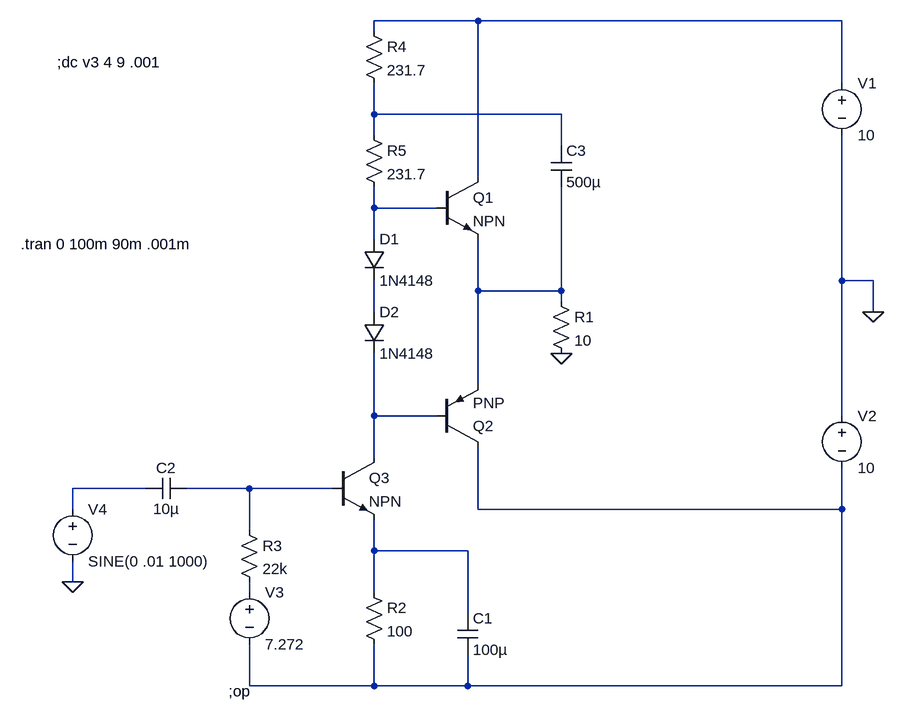
[diagram p0: schematic claseabteo3.asc]
claseabteo3.asc, the LTspice schematic file:
Version 4
SHEET 1 888 732
WIRE 256 -320 96 -320
WIRE 816 -320 256 -320
WIRE 96 -304 96 -320
WIRE 816 -224 816 -320
WIRE 96 -176 96 -224
WIRE 384 -176 96 -176
WIRE 96 -144 96 -176
WIRE 384 -128 384 -176
WIRE 256 -80 256 -320
WIRE 96 -32 96 -64
WIRE 144 -32 96 -32
WIRE 192 -32 144 -32
WIRE 96 16 96 -32
WIRE 816 80 816 -144
WIRE 864 80 816 80
WIRE 256 96 256 16
WIRE 288 96 256 96
WIRE 384 96 384 -64
WIRE 384 96 288 96
WIRE 384 112 384 96
WIRE 96 128 96 80
WIRE 864 128 864 80
WIRE 256 240 256 96
WIRE 96 288 96 192
WIRE 144 288 96 288
WIRE 192 288 144 288
WIRE 816 288 816 80
WIRE 96 352 96 288
WIRE -256 400 -368 400
WIRE -96 400 -192 400
WIRE 32 400 -96 400
WIRE -368 432 -368 400
WIRE 256 432 256 336
WIRE 816 432 816 368
WIRE 816 432 256 432
WIRE -96 464 -96 400
WIRE 96 496 96 448
WIRE 240 496 96 496
WIRE -368 544 -368 512
WIRE -96 560 -96 544
WIRE 96 560 96 496
WIRE 240 592 240 496
WIRE -96 704 -96 640
WIRE 96 704 96 640
WIRE 96 704 -96 704
WIRE 240 704 240 656
WIRE 240 704 96 704
WIRE 816 704 816 432
WIRE 816 704 240 704
FLAG 864 128 0
FLAG 384 192 0
FLAG -368 544 0
DATAFLAG 288 96 ""
DATAFLAG 96 496 ""
DATAFLAG 144 -32 ""
DATAFLAG 144 288 ""
SYMBOL voltage 816 -240 R0
WINDOW 123 0 0 Left 2
WINDOW 39 0 0 Left 2
SYMATTR InstName V1
SYMATTR Value 10
SYMBOL voltage 816 272 R0
WINDOW 123 0 0 Left 2
WINDOW 39 0 0 Left 2
SYMATTR InstName V2
SYMATTR Value 10
SYMBOL diode 80 16 R0
SYMATTR InstName D1
SYMATTR Value 1N4148
SYMBOL diode 80 128 R0
SYMATTR InstName D2
SYMATTR Value 1N4148
SYMBOL res 368 96 R0
SYMATTR InstName R1
SYMATTR Value 10
SYMBOL res 80 544 R0
SYMATTR InstName R2
SYMATTR Value 100
SYMBOL cap 224 592 R0
SYMATTR InstName C1
SYMATTR Value 100µ
SYMBOL res -112 448 R0
SYMATTR InstName R3
SYMATTR Value 22k
SYMBOL voltage -96 544 R0
WINDOW 123 0 0 Left 2
WINDOW 39 0 0 Left 2
SYMATTR InstName V3
SYMATTR Value 7.272
SYMBOL cap -192 384 R90
WINDOW 0 0 32 VBottom 2
WINDOW 3 32 32 VTop 2
SYMATTR InstName C2
SYMATTR Value 10µ
SYMBOL voltage -368 416 R0
WINDOW 123 0 0 Left 2
WINDOW 39 0 0 Left 2
SYMATTR InstName V4
SYMATTR Value SINE(0 .01 1000)
SYMBOL npn 192 -80 R0
SYMATTR InstName Q1
SYMBOL pnp 192 336 M180
SYMATTR InstName Q2
SYMBOL npn 32 352 R0
SYMATTR InstName Q3
SYMBOL res 80 -320 R0
SYMATTR InstName R4
SYMATTR Value 231.7
SYMBOL res 80 -160 R0
SYMATTR InstName R5
SYMATTR Value 231.7
SYMBOL cap 368 -128 R0
SYMATTR InstName C3
SYMATTR Value 500µ
TEXT -128 712 Left 2 !;op
TEXT -392 -256 Left 2 !;dc v3 4 9 .001
TEXT -448 24 Left 2 !.tran 0 100m 90m .001m

The netlist it stands for:
* claseabteo3.asc
V1 N001 0 10
V2 0 N009 10
D1 N003 N005 1N4148
D2 N005 N006 1N4148
R1 N004 0 10
R2 N010 N009 100
C1 N010 N009 100µ
R3 N008 N011 22k
V3 N011 N009 7.272
C2 N008 N007 10µ
V4 N007 0 SINE(0 .01 1000)
Q1 N001 N003 N004 0 NPN
Q2 N009 N006 N004 0 PNP
Q3 N006 N008 N010 0 NPN
R4 N001 N002 231.7
R5 N002 N003 231.7
C3 N002 N004 500µ
.model D D
.lib standard.dio
.model NPN NPN
.model PNP PNP
.lib standard.bjt
;op
;dc v3 4 9 .001
.tran 0 100m 90m .001m
.backanno
.end